# EAGLE schematic AFIBRPIComputeBoard (EAGLE 7.3.0)
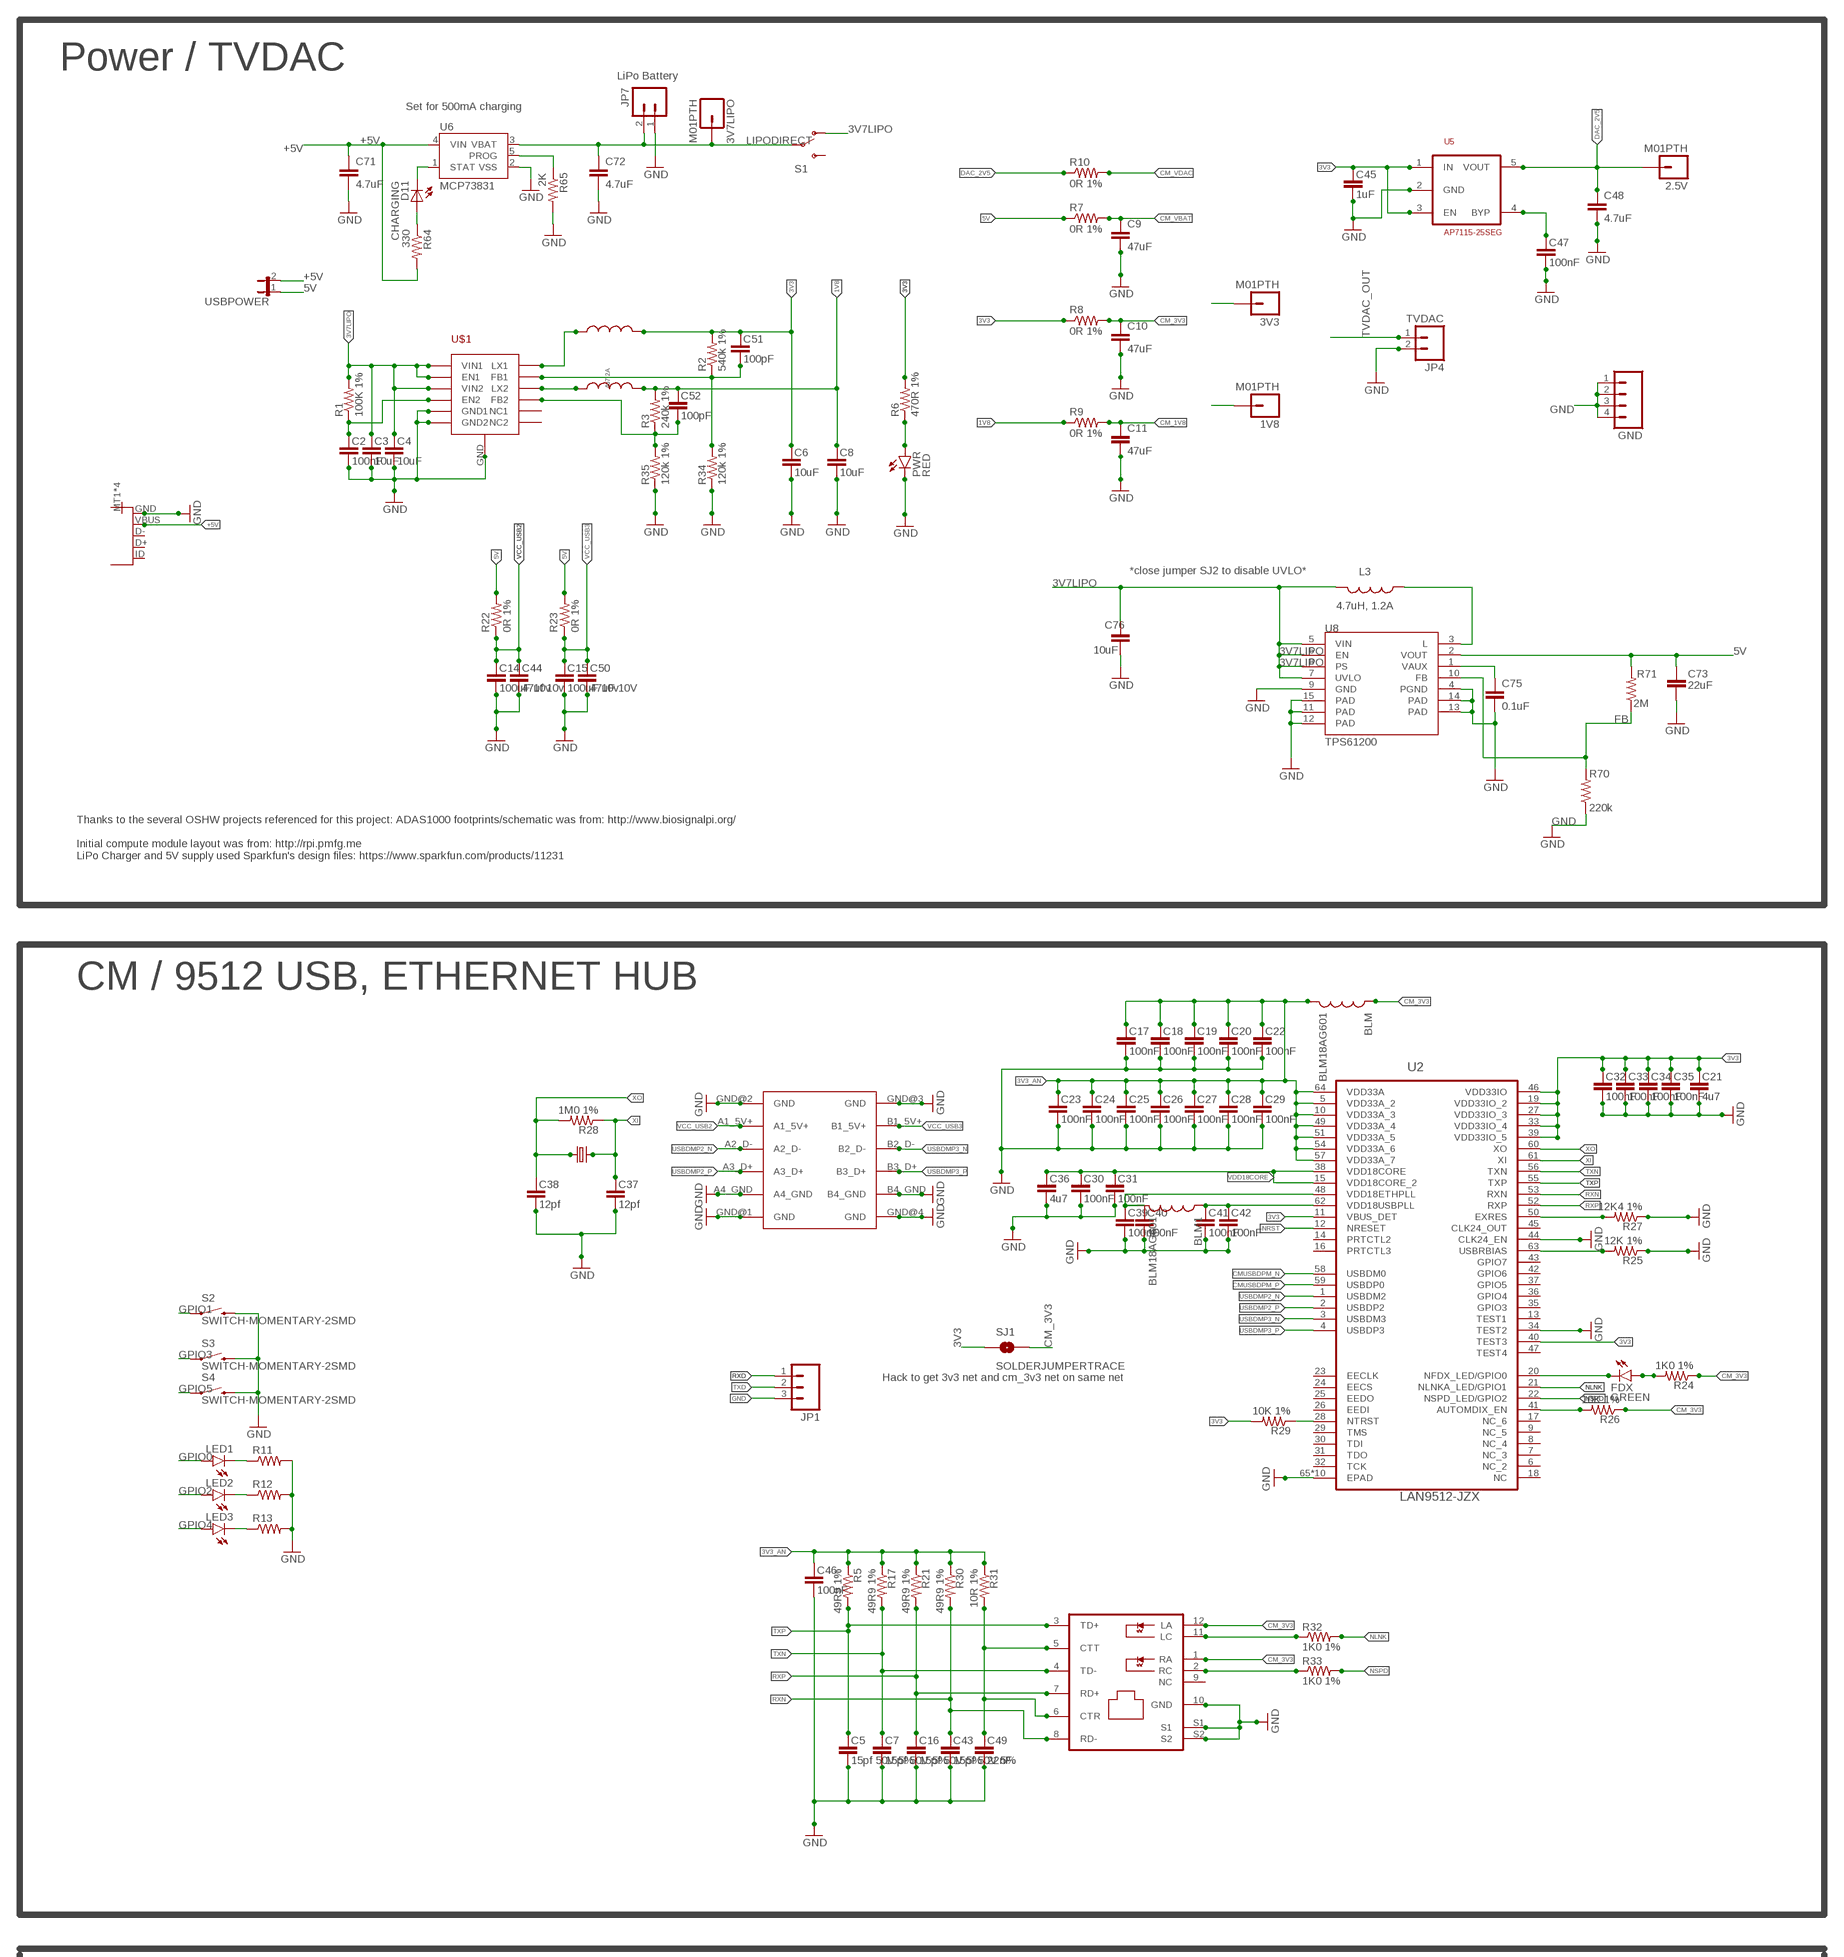
[diagram p0: schematic, sheet 1, part 1 of 3]
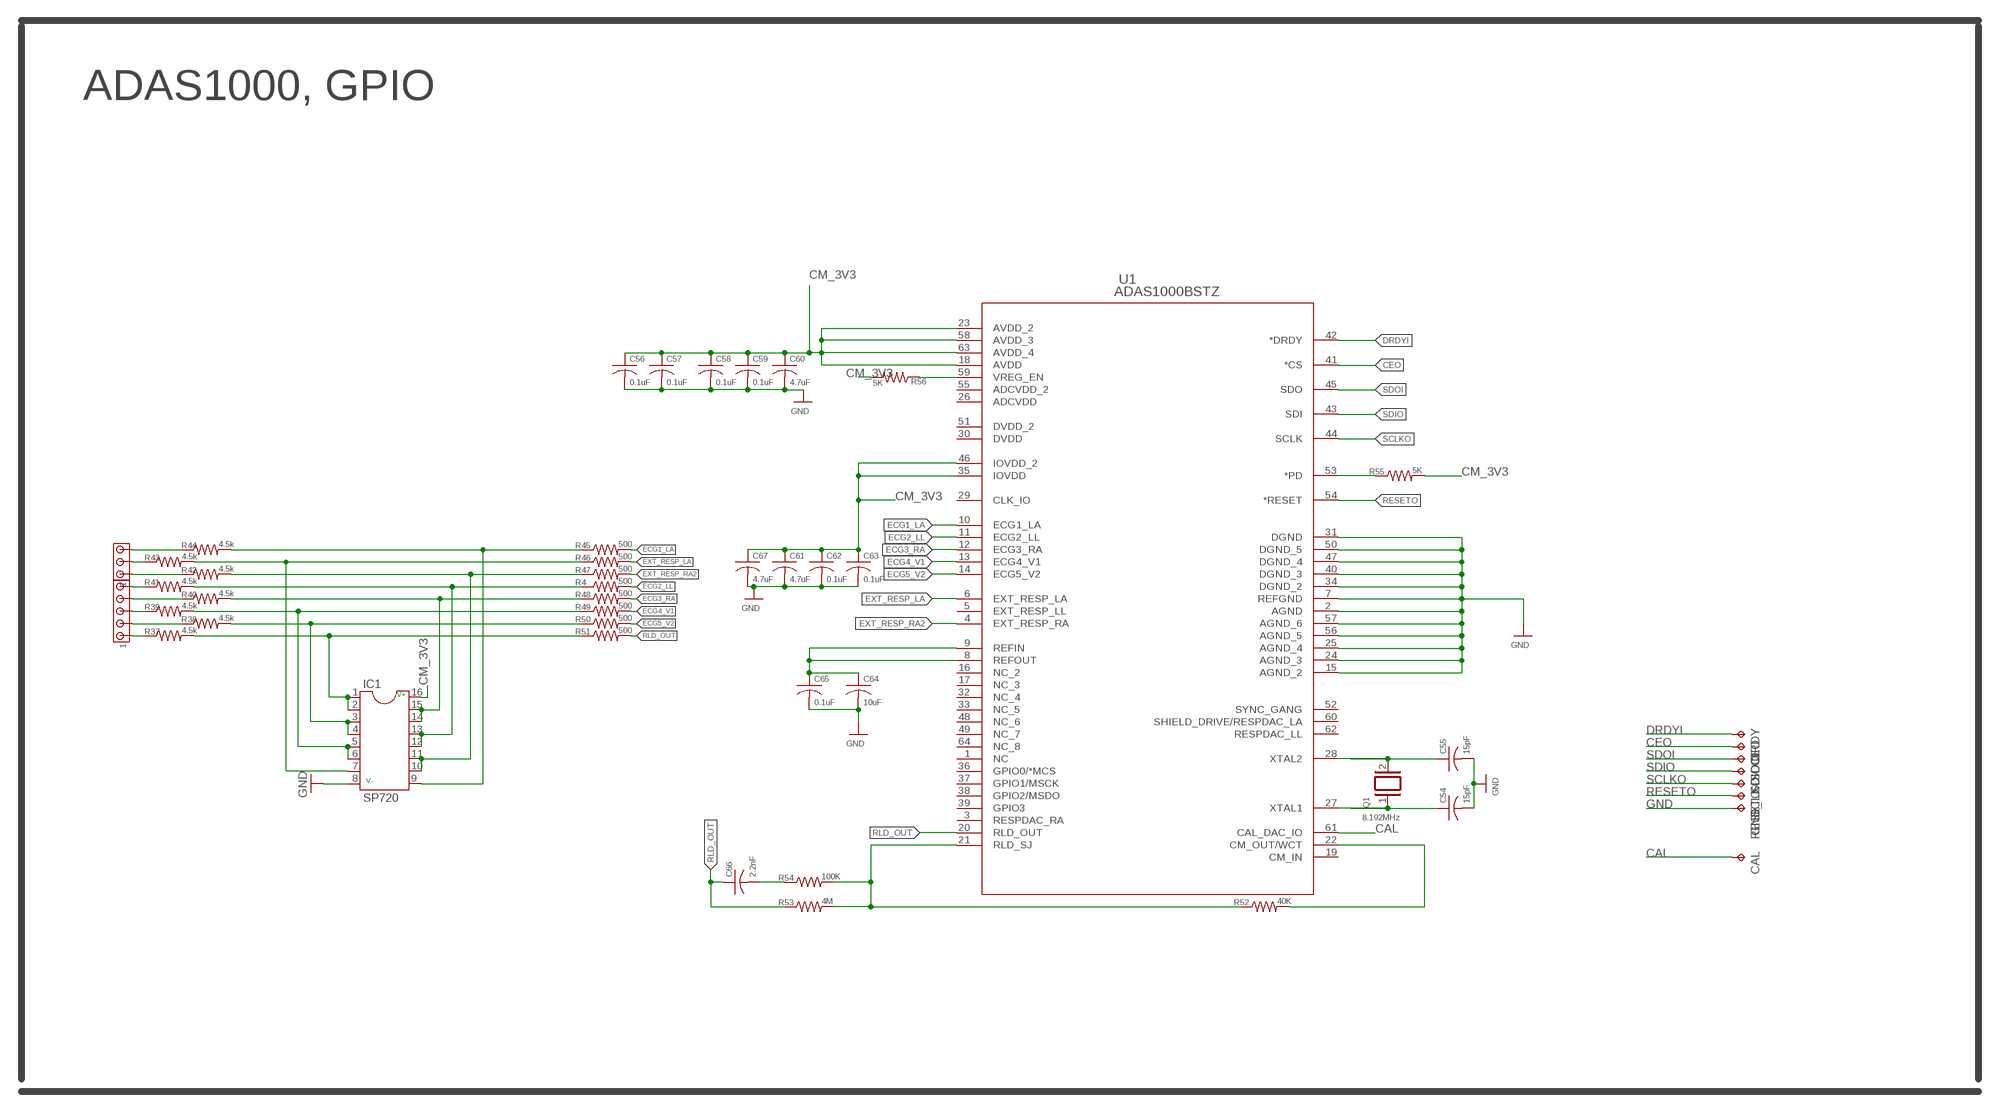
[diagram p1: schematic, sheet 1, part 2 of 3]
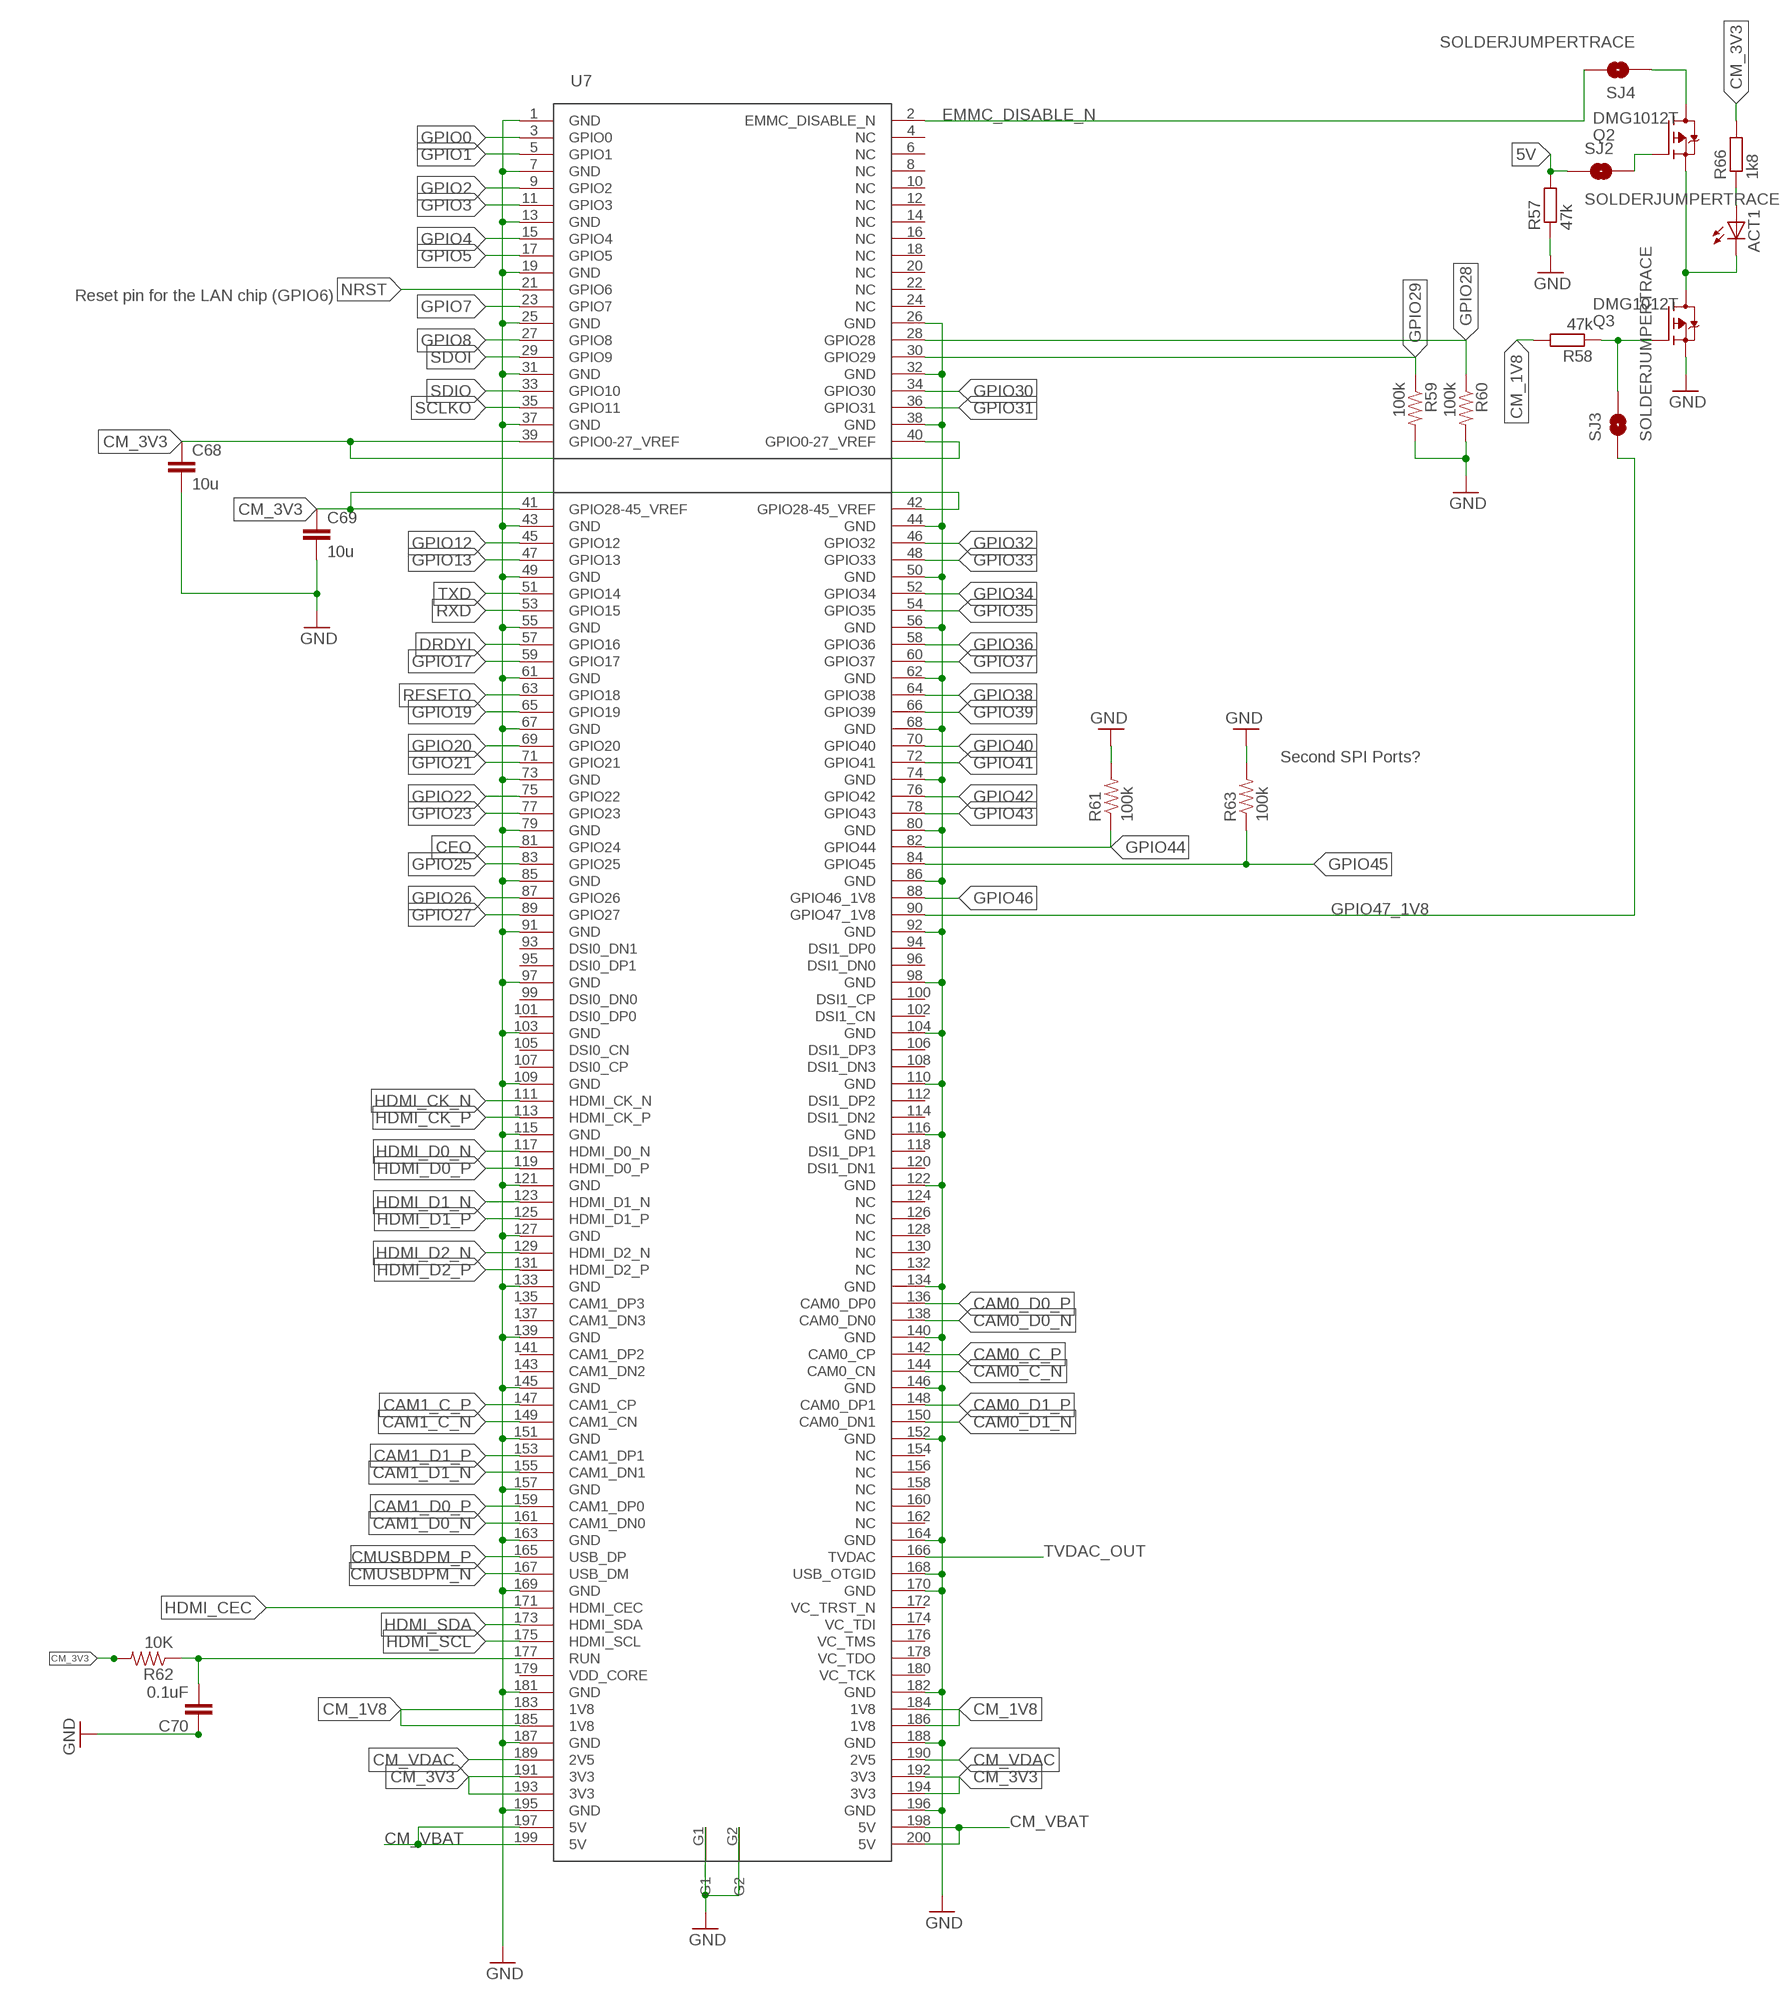
[diagram p2: schematic, sheet 1, part 3 of 3]

## Parts
1V8  M01PTH  [1X01]
2.5V  M01PTH  [1X01]
3V3  M01PTH  [1X01]
3V7LIPO  M01PTH  [1X01]
ACT1  LEDCHIP-LED0603  [CHIP-LED0603]
BLM  BLM18AG601  INDUCTOR0603  [0603]
BLM1  BLM18AG601  INDUCTOR0603  [0603]
C2  100nF  C_0402  [0402]
C3  10uF  C_0805  [0805]
C4  10uF  C_0805  [0805]
C5  15pf 50V 5%  C_0402  [0402]
C6  10uF  C_0805  [0805]
C7  15pf 50V 5%  C_0402  [0402]
C8  10uF  C_0805  [0805]
C9  47uF  CAP0603-CAP  [0603-CAP]
C10  47uF  CAP0603-CAP  [0603-CAP]
C11  47uF  CAP0603-CAP  [0603-CAP]
C14  100uF 10v  C_1206  [1206]
C15  100uF 10v  C_1206  [1206]
C16  15pf 50V 5%  C_0402  [0402]
C17  100nF  C_0402  [0402]
C18  100nF  C_0402  [0402]
C19  100nF  C_0402  [0402]
C20  100nF  C_0402  [0402]
C21  4u7  C_0402  [0402]
C22  100nF  C_0402  [0402]
C23  100nF  C_0402  [0402]
C24  100nF  C_0402  [0402]
C25  100nF  C_0402  [0402]
C26  100nF  C_0402  [0402]
C27  100nF  C_0402  [0402]
C28  100nF  C_0402  [0402]
C29  100nF  C_0402  [0402]
C30  100nF  C_0402  [0402]
C31  100nF  C_0402  [0402]
C32  100nF  C_0402  [0402]
C33  100nF  C_0402  [0402]
C34  100nF  C_0402  [0402]
C35  100nF  C_0402  [0402]
C36  4u7  C_0402  [0402]
C37  12pf  C_0402  [0402]
C38  12pf  C_0402  [0402]
C39  100nF  C_0402  [0402]
C40  100nF  C_0402  [0402]
C41  100nF  C_0402  [0402]
C42  100nF  C_0402  [0402]
C43  15pf 50V 5%  C_0402  [0402]
C44  47uf 10v  C_0805  [0805]
C45  1uF  C_0402  [0402]
C46  100nF  C_0402  [0402]
C47  100nF  C_0402  [0402]
C48  4.7uF  4.7UF-6.3V-10%(0603)0603  [0603-CAP]
C49  22nF  C_0805  [0805]
C50  47uF 10V  C_0805  [0805]
C51  100pF  C_0402  [0402]
C52  100pF  C_0402  [0402]
C54  15pF  C-USC0805  [C0805]
C55  15pF  C-USC0805  [C0805]
C56  0.1uF  C-USC0805  [C0805]
C57  0.1uF  C-USC0805  [C0805]
C58  0.1uF  C-USC0805  [C0805]
C59  0.1uF  C-USC0805  [C0805]
C60  4.7uF  C-USC0805  [C0805]
C61  4.7uF  C-USC0805  [C0805]
C62  0.1uF  C-USC0805  [C0805]
C63  0.1uF  C-USC0805  [C0805]
C64  10uF  C-USC0805  [C0805]
C65  0.1uF  C-USC0805  [C0805]
C66  2.2nF  C-USC0805  [C0805]
C67  4.7uF  C-USC0805  [C0805]
C68  10u  CAP0603-CAP  [0603-CAP]
C69  10u  CAP0603-CAP  [0603-CAP]
C70  0.1uF  CAP0603-CAP  [0603-CAP]
C71  4.7uF  CAP0402-CAP  [0402-CAP]
C72  4.7uF  CAP0402-CAP  [0402-CAP]
C73  22uF  CAP0603-CAP  [0603-CAP]
C75  0.1uF  CAP0603-CAP  [0603-CAP]
C76  10uF  CAP0603-CAP  [0603-CAP]
CAL  TPPAD1-13  [P1-13]
CEO  TPPAD1-13  [P1-13]
D11  CHARGING  LED0603  [LED-0603]
DRDY  TPPAD1-13  [P1-13]
FDX  GREEN  LED0603  [LED-0603]
GND  M04PTH  [1X04]
GND_  TPPAD1-13  [P1-13]
IC1  SP720  DIL16  [DIL16]
J1  J3011  [J30]
J2  JUMPERS  MTA03-100  [10X03MTA]
J3  JUMPERS  MTA05-100  [10X05MTA]
JP1  M03PTH  [1X03]
JP3  USB-IDMICRO  [USB-MICRO]
JP4  TVDAC  M02PTH  [1X02]
JP7  LiPo Battery  M02-JST-2MM-SMT  [JST-2-SMD]
L1  4.7u 2A  INDUCTOR-SRN4018  [SRN4018]
L2  4.7u 2A  INDUCTOR-SRN4018  [SRN4018]
L3  4.7uH, 1.2A  INDUCTOR.  [CDRH2D09]
LED1  LED0603  [LED-0603]
LED2  LED0603  [LED-0603]
LED3  LED0603  [LED-0603]
PWR  RED  LED0603  [LED-0603]
Q1  8.192MHz  XTAL/S  [QS]
Q2  DMG1012T  BSA223SP  [SC75_INFINEON]
Q3  DMG1012T  BSA223SP  [SC75_INFINEON]
R1  100K 1%  RESISTOR0402-RES  [0402-RES]
R2  540k 1%  RESISTOR0402-RES  [0402-RES]
R3  240k 1%  RESISTOR0402-RES  [0402-RES]
R4  500  RESISTOR0603  [0603-RES]
R5  49R9 1%  RESISTOR0402-RES  [0402-RES]
R6  470R 1%  RESISTOR0402-RES  [0402-RES]
R7  0R 1%  RESISTOR0603  [0603-RES]
R8  0R 1%  RESISTOR0603  [0603-RES]
R9  0R 1%  RESISTOR0603  [0603-RES]
R10  0R 1%  RESISTOR0603  [0603-RES]
R11  RESISTOR0603  [0603-RES]
R12  RESISTOR0603  [0603-RES]
R13  RESISTOR0603  [0603-RES]
R17  49R9 1%  RESISTOR0402-RES  [0402-RES]
R21  49R9 1%  RESISTOR0402-RES  [0402-RES]
R22  0R 1%  RESISTOR0603  [0603-RES]
R23  0R 1%  RESISTOR0603  [0603-RES]
R24  1K0 1%  RESISTOR0402-RES  [0402-RES]
R25  12K 1%  RESISTOR0402-RES  [0402-RES]
R26  10K 1%  RESISTOR0402-RES  [0402-RES]
R27  12K4 1%  RESISTOR0402-RES  [0402-RES]
R28  1M0 1%  RESISTOR0402-RES  [0402-RES]
R29  10K 1%  RESISTOR0402-RES  [0402-RES]
R30  49R9 1%  RESISTOR0402-RES  [0402-RES]
R31  10R 1%  RESISTOR0402-RES  [0402-RES]
R32  1K0 1%  RESISTOR0402-RES  [0402-RES]
R33  1K0 1%  RESISTOR0402-RES  [0402-RES]
R34  120k 1%  RESISTOR0402-RES  [0402-RES]
R35  120k 1%  RESISTOR0402-RES  [0402-RES]
R37  4.5k  RESISTOR0603-RES  [0603-RES]
R38  4.5k  RESISTOR0603-RES  [0603-RES]
R39  4.5k  RESISTOR0603-RES  [0603-RES]
R40  4.5k  RESISTOR0603-RES  [0603-RES]
R41  4.5k  RESISTOR0603-RES  [0603-RES]
R42  4.5k  RESISTOR0603-RES  [0603-RES]
R43  4.5k  RESISTOR0603-RES  [0603-RES]
R44  4.5k  RESISTOR0603-RES  [0603-RES]
R45  500  RESISTOR0603  [0603-RES]
R46  500  RESISTOR0603  [0603-RES]
R47  500  RESISTOR0603  [0603-RES]
R48  500  RESISTOR0603  [0603-RES]
R49  500  RESISTOR0603  [0603-RES]
R50  500  RESISTOR0603  [0603-RES]
R51  500  RESISTOR0603  [0603-RES]
R52  40K  RESISTOR0603-RES  [0603-RES]
R53  4M  RESISTOR0603-RES  [0603-RES]
R54  100K  RESISTOR0603-RES  [0603-RES]
R55  5K  RESISTOR0603-RES  [0603-RES]
R56  5K  RESISTOR0603-RES  [0603-RES]
R57  47k  R-EU_R0603  [R0603]
R58  47k  R-EU_R0603  [R0603]
R59  100k  RESISTOR0603  [0603-RES]
R60  100k  RESISTOR0603  [0603-RES]
R61  100k  RESISTOR0603  [0603-RES]
R62  10K  RESISTOR0603  [0603-RES]
R63  100k  RESISTOR0603  [0603-RES]
R64  330  RESISTOR0402-RES  [0402-RES]
R65  2K  RESISTOR0402-RES  [0402-RES]
R66  1k8  R-EU_R0603  [R0603]
R70  220k  RESISTOR0402-RES  [0402-RES]
R71  2M  RESISTOR0402-RES  [0402-RES]
RESETO  TPPAD1-13  [P1-13]
S1  SWITCH-SPDT-SMD-A  [SWITCH-SPST-SMD-A]
S2  SWITCH-MOMENTARY-2SMD  [TACTILE-SWITCH-SMD]
S3  SWITCH-MOMENTARY-2SMD  [TACTILE-SWITCH-SMD]
S4  SWITCH-MOMENTARY-2SMD  [TACTILE-SWITCH-SMD]
SCLKO  TPPAD1-13  [P1-13]
SDIO  TPPAD1-13  [P1-13]
SDOI  TPPAD1-13  [P1-13]
SJ1  SOLDERJUMPERTRACE  [SJ_2S-TRACE]
SJ2  SOLDERJUMPERTRACE  [SJ_2S-TRACE]
SJ3  SOLDERJUMPERTRACE  [SJ_2S-TRACE]
SJ4  SOLDERJUMPERTRACE  [SJ_2S-TRACE]
U1  ADAS1000BSTZ  [ST_64_2]
U2  LAN9512-JZX  [QFN50P900X900X100-65N]
U5  AP7115-25SEG  74LVC1G79GW  [SOT353]
U6  MCP73831  [SOT23-5]
U7  RASPI  [SO-DIMM]
U8  TPS61200  [QFN-10_PAD]
U$1  WDFN-12L  [WDFN-12L]
USB1  72309USB-TYPE-A  [72309]
USBPOWER  JUMPER-2PTH  [1X02]
Y1  CRYSTAL5X3  [CRYSTAL-SMD-5X3]

## Nets
1V8: C8.1 C52.1 L2.P$2 R3.2 R9.1
3V3: C6.1 C21.1 C32.1 C33.1 C34.1 C35.1 C45.1 C51.1 L1.P$2 R2.2 R6.2 R8.1 R29.2 SJ1.1 U2.11(VBUS_DET) U2.19(VDD33IO_2) U2.27(VDD33IO_3) U2.33(VDD33IO_4) U2.39(VDD33IO_5) U2.40(TEST3) U2.46(VDD33IO) U5.1(IN) U5.3(EN)
3V3_AN: BLM.2 C17.1 C18.1 C19.1 C20.1 C22.1 C23.1 C24.1 C25.1 C26.1 C27.1 C28.1 C29.1 C46.1 R5.1 R17.1 R21.1 R30.1 R31.1 U2.5(VDD33A_2) U2.10(VDD33A_3) U2.49(VDD33A_4) U2.51(VDD33A_5) U2.54(VDD33A_6) U2.57(VDD33A_7) U2.64(VDD33A)
3V7LIPO: C3.1 C4.1 C76.1 L3.P$2 R1.2 S1.1(O) U8.5(VIN) U8.6(EN) U8.7(UVLO) U8.8(PS) U$1.1(VIN2) U$1.6(EN1) U$1.7(VIN1)
5V: C73.1 R7.1 R22.2 R23.2 R57.2 R71.2 SJ2.1 U8.2(VOUT) USBPOWER.1
+5V: C71.1 JP3.VBUS R64.2 U6.4(VIN) USBPOWER.2
CAL: CAL.TP U1.61(CAL_DAC_IO)
CAM0_C_N: U7.144(CAM0_CN)
CAM0_C_P: U7.142(CAM0_CP)
CAM0_D0_N: U7.138(CAM0_DN0)
CAM0_D0_P: U7.136(CAM0_DP0)
CAM0_D1_N: U7.150(CAM0_DN1)
CAM0_D1_P: U7.148(CAM0_DP1)
CAM1_C_N: U7.149(CAM1_CN)
CAM1_C_P: U7.147(CAM1_CP)
CAM1_D0_N: U7.161(CAM1_DN0)
CAM1_D0_P: U7.159(CAM1_DP0)
CAM1_D1_N: U7.155(CAM1_DN1)
CAM1_D1_P: U7.153(CAM1_DP1)
CEO: CEO.TP U1.41(*CS) U7.81(GPIO24)
CM_1V8: 1V8.1 C11.1 R9.2 R58.2 U7.183(1V8) U7.184(1V8) U7.185(1V8) U7.186(1V8)
CM_3V3: 3V3.1 BLM.1 C10.1 C56.1 C57.1 C58.1 C59.1 C60.1 C61.1 C62.1 C63.1 C67.1 C68.1 C69.1 IC1.16 J1.1(RA) J1.12(LA) R8.2 R24.1 R26.1 R55.2 R56.2 R62.2 R66.2 SJ1.2 U1.18(AVDD) U1.23(AVDD_2) U1.35(IOVDD) U1.46(IOVDD_2) U1.58(AVDD_3) U1.63(AVDD_4) U7.39(GPIO0-27_VREF) U7.40(GPIO0-27_VREF) U7.41(GPIO28-45_VREF) U7.42(GPIO28-45_VREF) U7.191(3V3) U7.192(3V3) U7.193(3V3) U7.194(3V3)
CM_VBAT: C9.1 R7.2 U7.197(5V) U7.198(5V) U7.199(5V) U7.200(5V)
CM_VDAC: R10.2 U7.189(2V5) U7.190(2V5)
CMUSBDPM_N: U2.58(USBDM0) U7.167(USB_DM)
CMUSBDPM_P: U2.59(USBDP0) U7.165(USB_DP)
DAC_2V5: 2.5V.1 C48.1 R10.1 U5.5(VOUT)
DRDYI: DRDY.TP U1.42(*DRDY) U7.57(GPIO16)
ECG1_LA: R45.2 U1.10(ECG1_LA)
ECG2_LL: R4.2 U1.11(ECG2_LL)
ECG3_RA: R48.2 U1.12(ECG3_RA)
ECG4_V1: R49.2 U1.13(ECG4_V1)
ECG5_V2: R50.2 U1.14(ECG5_V2)
EMMC_DISABLE_N: SJ4.2 U7.2(EMMC_DISABLE_N)
EXT_RESP_LA: R46.2 U1.6(EXT_RESP_LA)
EXT_RESP_RA2: R47.2 U1.4(EXT_RESP_RA)
FB: R70.2 R71.1 U8.10(FB)
GND: C2.2 C3.2 C4.2 C5.2 C6.2 C7.2 C8.2 C9.2 C10.2 C11.2 C14.2 C15.2 C16.2 C17.2 C18.2 C19.2 C20.2 C21.2 C22.2 C23.2 C24.2 C25.2 C26.2 C27.2 C28.2 C29.2 C30.2 C31.2 C32.2 C33.2 C34.2 C35.2 C36.2 C37.2 C38.2 C39.2 C40.2 C41.2 C42.2 C43.2 C44.2 C45.2 C46.2 C47.2 C48.2 C49.2 C50.2 C54.2 C55.2 C56.2 C57.2 C58.2 C59.2 C60.2 C61.2 C62.2 C63.2 C64.2 C65.2 C67.2 C68.2 C69.2 C70.1 C71.2 C72.2 C73.2 C75.2 C76.2 GND.1 GND.2 GND.3 GND.4 GND_.TP IC1.8 J1.10(GND) J1.S1 J1.S2 JP1.3 JP3.GND JP4.2 JP7.1 Q3.3(S) R11.2 R12.2 R13.2 R25.1 R27.1 R34.1 R35.1 R57.1 R59.2 R60.2 R61.2 R63.2 R65.2 R70.1 S2.3 S3.3 S4.3 U1.2(AGND) U1.7(REFGND) U1.15(AGND_2) U1.24(AGND_3) U1.25(AGND_4) U1.31(DGND) U1.34(DGND_2) U1.40(DGND_3) U1.47(DGND_4) U1.50(DGND_5) U1.56(AGND_5) U1.57(AGND_6) U2.34(TEST2) U2.44(CLK24_EN) U2.65(EPAD) U2.GND@1(EPAD) U2.GND@2(EPAD) U2.GND@3(EPAD) U2.GND@4(EPAD) U2.GND@5(EPAD) U2.GND@6(EPAD) U2.GND@7(EPAD) U2.GND@8(EPAD) U2.GND@9(EPAD) U5.2(GND) U6.2(VSS) U7.1(GND) U7.7(GND) U7.13(GND) U7.19(GND) U7.25(GND) U7.26(GND) U7.31(GND) U7.32(GND) U7.37(GND) U7.38(GND) U7.43(GND) U7.44(GND) U7.49(GND) U7.50(GND) U7.55(GND) U7.56(GND) U7.61(GND) U7.62(GND) U7.67(GND) U7.68(GND) U7.73(GND) U7.74(GND) U7.79(GND) U7.80(GND) U7.85(GND) U7.86(GND) U7.91(GND) U7.92(GND) U7.97(GND) U7.98(GND) U7.103(GND) U7.104(GND) U7.109(GND) U7.110(GND) U7.115(GND) U7.116(GND) U7.121(GND) U7.122(GND) U7.127(GND) U7.133(GND) U7.134(GND) U7.139(GND) U7.140(GND) U7.145(GND) U7.146(GND) U7.151(GND) U7.152(GND) U7.157(GND) U7.163(GND) U7.164(GND) U7.168(USB_OTGID) U7.169(GND) U7.170(GND) U7.181(GND) U7.182(GND) U7.187(GND) U7.188(GND) U7.195(GND) U7.196(GND) U7.G1 U7.G2 U8.4(PGND) U8.9(GND) U8.11(PAD) U8.12(PAD) U8.13(PAD) U8.14(PAD) U8.15(PAD) U$1.3(GND1) U$1.9(GND2) U$1.GND USB1.A4_GND USB1.B4_GND USB1.GND@1(GND) USB1.GND@2(GND) USB1.GND@3(GND) USB1.GND@4(GND)
GPIO0: LED1.A U7.3(GPIO0)
GPIO1: S2.1 U7.5(GPIO1)
GPIO2: LED2.A U7.9(GPIO2)
GPIO3: S3.1 U7.11(GPIO3)
GPIO4: LED3.A U7.15(GPIO4)
GPIO5: S4.1 U7.17(GPIO5)
GPIO7: U7.23(GPIO7)
GPIO8: U7.27(GPIO8)
GPIO12: U7.45(GPIO12)
GPIO13: U7.47(GPIO13)
GPIO17: U7.59(GPIO17)
GPIO19: U7.65(GPIO19)
GPIO20: U7.69(GPIO20)
GPIO21: U7.71(GPIO21)
GPIO22: U7.75(GPIO22)
GPIO23: U7.77(GPIO23)
GPIO25: U7.83(GPIO25)
GPIO26: U7.87(GPIO26)
GPIO27: U7.89(GPIO27)
GPIO28: R60.1 U7.28(GPIO28)
GPIO29: R59.1 U7.30(GPIO29)
GPIO30: U7.34(GPIO30)
GPIO31: U7.36(GPIO31)
GPIO32: U7.46(GPIO32)
GPIO33: U7.48(GPIO33)
GPIO34: U7.52(GPIO34)
GPIO35: U7.54(GPIO35)
GPIO36: U7.58(GPIO36)
GPIO37: U7.60(GPIO37)
GPIO38: U7.64(GPIO38)
GPIO39: U7.66(GPIO39)
GPIO40: U7.70(GPIO40)
GPIO41: U7.72(GPIO41)
GPIO42: U7.76(GPIO42)
GPIO43: U7.78(GPIO43)
GPIO44: R61.1 U7.82(GPIO44)
GPIO45: R63.1 U7.84(GPIO45)
GPIO46: U7.88(GPIO46_1V8)
GPIO47_1V8: SJ3.1 U7.90(GPIO47_1V8)
HDMI_CEC: U7.171(HDMI_CEC)
HDMI_CK_N: U7.111(HDMI_CK_N)
HDMI_CK_P: U7.113(HDMI_CK_P)
HDMI_D0_N: U7.117(HDMI_D0_N)
HDMI_D0_P: U7.119(HDMI_D0_P)
HDMI_D1_N: U7.123(HDMI_D1_N)
HDMI_D1_P: U7.125(HDMI_D1_P)
HDMI_D2_N: U7.129(HDMI_D2_N)
HDMI_D2_P: U7.131(HDMI_D2_P)
HDMI_SCL: U7.175(HDMI_SCL)
HDMI_SDA: U7.173(HDMI_SDA)
JUMPERS: J2.1 R42.1
LIPODIRECT: 3V7LIPO.1 C72.1 JP7.2 S1.2(P) U6.3(VBAT)
N$1: L1.P$1 U$1.8(LX1)
N$2: C51.2 R2.1 R34.2 U$1.4(FB1)
N$3: C2.1 R1.1 U$1.12(EN2)
N$4: L2.P$1 U$1.2(LX2)
N$6: C52.2 R3.1 R35.2 U$1.10(FB2)
N$7: PWR.A R6.1
N$9: Q2.2(D) SJ4.1
N$10: Q3.1(G) R58.1 SJ3.2
N$11: LED3.C R13.1
N$12: LED2.C R12.1
N$13: FDX.A R24.2
N$14: LED1.C R11.1
N$15: Q2.1(G) SJ2.2
N$16: R25.2 U2.63(USBRBIAS)
N$17: PWR.C
N$19: J3.1 R37.1
N$21: C47.1 U5.4(BYP)
N$22: BLM1.1 C41.1 C42.1 U2.62(VDD18USBPLL)
N$23: BLM1.2 C39.1 C40.1 U2.48(VDD18ETHPLL)
N$24: R26.2 U2.41(AUTOMDIX_EN)
N$25: R27.2 U2.50(EXRES)
N$26: R29.1 U2.28(NTRST)
N$27: J1.11(LC) R32.1
N$28: J1.2(RC) R33.1
N$29: C49.1 J1.5(CTT) J1.6(CTR) R31.2
N$30: FDX.C U2.20(NFDX_LED/GPIO0)
N$35: J3.2 R38.1
N$37: J3.3 R39.1
N$38: J3.4 R40.1
N$39: J3.5 R41.1
N$40: J2.2 R43.1
N$41: J2.3 R44.1
N$42: IC1.9 R44.2 R45.1
N$43: IC1.7 R43.2 R46.1
N$44: IC1.3 IC1.4 R38.2 R50.1
N$45: IC1.5 IC1.6 R39.2 R49.1
N$46: IC1.1 IC1.2 R37.2 R51.1
N$47: IC1.14 IC1.15 R40.2 R48.1
N$48: IC1.12 IC1.13 R4.1 R41.2
N$49: IC1.10 IC1.11 R42.2 R47.1
N$50: C55.1 Q1.2 U1.28(XTAL2)
N$51: C54.1 Q1.1 U1.27(XTAL1)
N$52: C66.2 R54.1
N$53: R55.1 U1.53(*PD)
N$54: R56.1 U1.59(VREG_EN)
N$55: R52.2 U1.22(CM_OUT/WCT)
N$56: C64.1 C65.1 U1.8(REFOUT) U1.9(REFIN)
N$57: R52.1 R53.2 R54.2 U1.21(RLD_SJ)
N$60: ACT1.C Q2.3(S) Q3.2(D)
N$61: D11.A R64.1
N$62: L3.P$1 U8.3(L)
N$63: C75.1 U8.1(VAUX)
N$65: ACT1.A R66.1
NLNK: R32.2 U2.21(NLNKA_LED/GPIO1)
NRST: U2.12(NRESET) U7.21(GPIO6)
NSPD: R33.2 U2.22(NSPD_LED/GPIO2)
PROG: R65.1 U6.5(PROG)
RESETO: RESETO.TP U1.54(*RESET) U7.63(GPIO18)
RLD_OUT: C66.1 R51.2 R53.1 U1.20(RLD_OUT)
RUNPIN: C70.2 R62.1 U7.177(RUN)
RXD: JP1.1 U7.53(GPIO15)
RXN: C43.1 J1.8(RD-) R30.2 U2.53(RXN)
RXP: C16.1 J1.7(RD+) R21.2 U2.52(RXP)
SCLKO: SCLKO.TP U1.44(SCLK) U7.35(GPIO11)
SDIO: SDIO.TP U1.43(SDI) U7.33(GPIO10)
SDOI: SDOI.TP U1.45(SDO) U7.29(GPIO9)
STAT: D11.C U6.1(STAT)
TVDAC_OUT: JP4.1 U7.166(TVDAC)
TXD: JP1.2 U7.51(GPIO14)
TXN: C7.1 J1.4(TD-) R17.2 U2.56(TXN)
TXP: C5.1 J1.3(TD+) R5.2 U2.55(TXP)
USBDMP2_N: U2.1(USBDM2) USB1.A2_D-
USBDMP2_P: U2.2(USBDP2) USB1.A3_D+
USBDMP3_N: U2.3(USBDM3) USB1.B2_D-
USBDMP3_P: U2.4(USBDP3) USB1.B3_D+
VCC_USB2: C14.1 C44.1 R22.1 USB1.A1_5V+
VCC_USB3: C15.1 C50.1 R23.1 USB1.B1_5V+
VDD18CORE: C30.1 C31.1 C36.1 U2.15(VDD18CORE_2) U2.38(VDD18CORE)
XI: C37.1 R28.1 U2.61(XI) Y1.3
XO: C38.1 R28.2 U2.60(XO) Y1.1
Unconnected: J1.9(NC) JP3.D+ JP3.D- JP3.ID JP3.MT1(SHELL) JP3.MT2(SHELL) JP3.P$1(SHELL) JP3.P$2(SHELL) S1.3(S) U1.1(NC) U1.3(RESPDAC_RA) U1.5(EXT_RESP_LL) U1.16(NC_2) U1.17(NC_3) U1.19(CM_IN) U1.26(ADCVDD) U1.29(CLK_IO) U1.30(DVDD) U1.32(NC_4) U1.33(NC_5) U1.36(GPIO0/*MCS) U1.37(GPIO1/MSCK) U1.38(GPIO2/MSDO) U1.39(GPIO3) U1.48(NC_6) U1.49(NC_7) U1.51(DVDD_2) U1.52(SYNC_GANG) U1.55(ADCVDD_2) U1.60(SHIELD_DRIVE/RESPDAC_LA) U1.62(RESPDAC_LL) U1.64(NC_8) U2.6(NC_2) U2.7(NC_3) U2.8(NC_4) U2.9(NC_5) U2.13(TEST1) U2.14(PRTCTL2) U2.16(PRTCTL3) U2.17(NC_6) U2.18(NC) U2.23(EECLK) U2.24(EECS) U2.25(EEDO) U2.26(EEDI) U2.29(TMS) U2.30(TDI) U2.31(TDO) U2.32(TCK) U2.35(GPIO3) U2.36(GPIO4) U2.37(GPIO5) U2.42(GPIO6) U2.43(GPIO7) U2.45(CLK24_OUT) U2.47(TEST4) U7.4(NC) U7.6(NC) U7.8(NC) U7.10(NC) U7.12(NC) U7.14(NC) U7.16(NC) U7.18(NC) U7.20(NC) U7.22(NC) U7.24(NC) U7.93(DSI0_DN1) U7.94(DSI1_DP0) U7.95(DSI0_DP1) U7.96(DSI1_DN0) U7.99(DSI0_DN0) U7.100(DSI1_CP) U7.101(DSI0_DP0) U7.102(DSI1_CN) U7.105(DSI0_CN) U7.106(DSI1_DP3) U7.107(DSI0_CP) U7.108(DSI1_DN3) U7.112(DSI1_DP2) U7.114(DSI1_DN2) U7.118(DSI1_DP1) U7.120(DSI1_DN1) U7.124(NC) U7.126(NC) U7.128(NC) U7.130(NC) U7.132(NC) U7.135(CAM1_DP3) U7.137(CAM1_DN3) U7.141(CAM1_DP2) U7.143(CAM1_DN2) U7.154(NC) U7.156(NC) U7.158(NC) U7.160(NC) U7.162(NC) U7.172(VC_TRST_N) U7.174(VC_TDI) U7.176(VC_TMS) U7.178(VC_TDO) U7.179(VDD_CORE) U7.180(VC_TCK) U$1.5(NC1) U$1.11(NC2)

## Notes on the sheet
- Power / TVDAC
- Set for 500mA charging
- *close jumper SJ2 to disable UVLO*
- Thanks to the several OSHW projects referenced for this project: ADAS1000 footprints/schematic was from: http://www.biosignalpi.org/
  
  Initial compute module layout was from: http://rpi.pmfg.me
  LiPo Charger and 5V supply used Sparkfun's design files: https://www.sparkfun.com/products/11231
- CM / 9512 USB, ETHERNET HUB
- Hack to get 3v3 net and cm_3v3 net on same net
- ADAS1000, GPIO
- V+
- V-
- Reset pin for the LAN chip (GPIO6)
- Second SPI Ports?

## Library data of the parts
1V8 2.5V 3V3 3V7LIPO = SparkFun-Connectors:M01: Header 1 Standard 1-pin 0.1" header. Use with straight break away headers (SKU : PRT-00116), right angle break away headers (PRT-00553), swiss pins (PRT-00743), machine pins (PRT-00117), and female headers (PRT-00115).
ACT1 = led:LED: LED OSRAM: - CHIPLED LG R971, LG N971, LY N971, LG Q971, LY Q971, LO R971, LY R971 LH N974, LH R974 LS Q976, LO Q976, LY Q976 LO Q996 - Hyper CHIPLED LW Q18S LB Q993, LB Q99A, LB R99A - SideLED LS A670, LO A670, LY A670, LG A670, LP A670 LB A673, LV A673, LT A673, LW A673 LH A674 LY A675 LS A676, LA A676, LO A676, LY A676, LW A676 LS A679, LY A679, LG A679 - Hyper Micro SIDELED® LS Y876, LA Y876, LO Y876, LY Y876 LT Y87S - SmartLED LW L88C, LW L88S LB L89C, LB L89S, LG L890 LS L89K, LO L89K, LY L89K LS L896, LA L896, LO L896, LY L896 - TOPLED LS T670, LO T670, LY T670, LG T670, LP T670 LSG T670, LSP T670, LSY T670, LOP T670, LYG T670 LG T671, LOG T671, LSG T671 LB T673, LV T673, LT T673, LW T673 LH T674 LS T676, LA T676, LO T676, LY T676, LB T676, LH T676, LSB T676, LW T676 LB T67C, LV T67C, LT T67C, LS T67K, LO T67K, LY T67K, LW E67C LS E67B, LA E67B, LO E67B, LY E67B, LB E67C, LV E67C, LT E67C LW T67C LS T679, LY T679, LG T679 LS T770, LO T770, LY T770, LG T770, LP T770 LB T773, LV T773, LT T773, LW T773 LH T774 LS E675, LA E675, LY E675, LS T675 LS T776, LA T776, LO T776, LY T776, LB T776 LHGB T686 LT T68C, LB T68C - Hyper Mini TOPLED® LB M676 - Mini TOPLED Santana® LG M470 LS M47K, LO M47K, LY M47K Source: http://www.osram.convergy.de LUXEON: - LUMILED® LXK2-PW12-R00, LXK2-PW12-S00, LXK2-PW14-U00, LXK2-PW14-V00 LXK2-PM12-R00, LXK2-PM12-S00, LXK2-PM14-U00 LXK2-PE12-Q00, LXK2-PE12-R00, LXK2-PE12-S00, LXK2-PE14-T00, LXK2-PE14-U00 LXK2-PB12-K00, LXK2-PB12-L00, LXK2-PB12-M00, LXK2-PB14-N00, LXK2-PB14-P00, LXK2-PB14-Q00 LXK2-PR12-L00, LXK2-PR12-M00, LXK2-PR14-Q00, LXK2-PR14-R00 LXK2-PD12-Q00, LXK2-PD12-R00, LXK2-PD12-S00 LXK2-PH12-R00, LXK2-PH12-S00 LXK2-PL12-P00, LXK2-PL12-Q00, LXK2-PL12-R00 Source: www.luxeon.com KINGBRIGHT: KA-3528ASYC Source: www.kingbright.com
BLM BLM1 = SparkFun-Passives:INDUCTOR: Inductors
C2 C5 C7 C14-C43 C45-C47 C51 C52 = C:C
C3 C4 C6 C8 C44 C49 C50 = C:C; MN: TDK Corp.; PARTNO: C2012X5R1Cxxxxxxx; VID: DK
C9-C11 C68-C70 C73 C75 C76 = SparkFun-Passives:CAP: Capacitor Standard 0603 ceramic capacitor, and 0.1" leaded capacitor.
C48 = SparkFun-Capacitors:4.7UF-6.3V-10%(0603): CAP-08280; PROD_ID: CAP-08280
C54-C67 = rcl:C-US: CAPACITOR, American symbol
C71 C72 = SparkFun:CAP: Capacitor Standard 0603 ceramic capacitor, and 0.1" leaded capacitor.
CAL CEO DRDY GND_ RESETO SCLKO SDIO SDOI = testpad:TP: Test pad
D11 = SparkFun:LED: LEDs Standard schematic elements and footprints for 5mm, 3mm, 1206, and 0603 sized LEDs. 5mm - Spark Fun Electronics SKU : COM-00529 (and others)
FDX LED1-LED3 PWR = SparkFun-LED:LED: LEDs Standard schematic elements and footprints for 5mm, 3mm, 1206, and 0603 sized LEDs. 5mm - Spark Fun Electronics SKU : COM-00529 (and others)
GND = SparkFun-Connectors:M04: Header 4 Standard 4-pin 0.1" header. Use with straight break away headers (SKU : PRT-00116), right angle break away headers (PRT-00553), swiss pins (PRT-00743), machine pins (PRT-00117), and female headers (PRT-00115). Molex polarized connector foot print use with SKU : PRT-08231 with associated crimp pins and housings. 1MM SMD Version SKU: PRT-10208
IC1 = ic-packageEdit:DIL16: Dual In Line / Socket
J1 = J3011:J3011
J2 = con-amp:MTA03-100: AMP connector
J3 = con-amp:MTA05-100: AMP connector
JP1 = SparkFun-Connectors:M03: Header 3 Standard 3-pin 0.1" header. Use with straight break away headers (SKU : PRT-00116), right angle break away headers (PRT-00553), swiss pins (PRT-00743), machine pins (PRT-00117), and female headers (PRT-00115). Molex polarized connector foot print use with SKU : PRT-08232 with associated crimp pins and housings.
JP3 = USB-ID:USB-ID; PROD_ID: CONN-09505
JP4 = SparkFun-Connectors:M02: Standard 2-pin 0.1" header. Use with - straight break away headers ( PRT-00116) - right angle break away headers (PRT-00553) - swiss pins (PRT-00743) - machine pins (PRT-00117) - female headers (PRT-00115) Molex polarized connector foot print use with: PRT-08233 with associated crimp pins and housings. 2.54_SCREWTERM for use with PRT-10571. 3.5mm Screw Terminal footprints for PRT-08084 5mm Screw Terminal footprints for use with PRT-08433
JP7 = SparkFun:M02: Header 2 Standard 2-pin 0.1" header. Use with straight break away headers (SKU : PRT-00116), right angle break away headers (PRT-00553), swiss pins (PRT-00743), machine pins (PRT-00117), and female headers (PRT-00115). Molex polarized connector foot print use with SKU : PRT-08233 with associated crimp pins and housings.
L1 = INDUCTOR:INDUCTOR
L2 = INDUCTOR:INDUCTOR; L2: 4u7 2A
L3 = SparkFun:INDUCTOR: Inductors
Q1 = special:XTAL/S: CRYSTAL
Q2 Q3 = transistor-fet:BSA223SP: OptiMOS(R)-P Small-Signal-Transistor P-Channel, Enhancement mode, Super Logic Level (2.5 V rated) Source: http://www.infineon.com/upload/Document/BSA223SP_Rev1.3.pdf
R1-R3 R5 R6 R17 R21 R24-R35 = RESISTORS:RESISTOR
R4 R7-R10 R22 R23 R45-R51 R59-R63 = SparkFun-ResistorsCustomer:RESISTOR: Resistor Basic schematic elements and footprints for 0603, 1206, and PTH resistors.
R11-R13 = SparkFun-Resistors:RESISTOR: Resistor Basic schematic elements and footprints for 0603, 1206, and PTH resistors.
R37-R44 R52-R56 = SparkFun-Passives:RESISTOR: Resistor Basic schematic elements and footprints for 0603, 1206, and PTH resistors.
R57 R58 R66 = rcl:R-EU_: RESISTOR, European symbol
R64 R65 R70 R71 = SparkFun:RESISTOR: Resistor Basic schematic elements and footprints for 0603, 1206, and PTH resistors.
S1 = SparkFun-Electromechanical_bak:SWITCH-SPDT: SPDT Switch Simple slide switch, Spark Fun Electronics SKU : COM-00102 DPDT SMT slide switch, AYZ0202, SWCH-08179
S2-S4 = SparkFun-Electromechanical:SWITCH-MOMENTARY-2: Various NO switches- pushbuttons, reed, etc; PROD_ID: SWCH-08247
SJ1-SJ4 = SparkFun-Retired:SOLDERJUMPER: Solder Jumper Standard SMD solder jumper. Used to automate production. Two varients : Normally Open and Normally Closed are the same, but have different paste layers. NC will have a large amount of paste and should jumper during reflow.
U1 = ADAS1000:ADAS1000BSTZ
U2 = LAN9512:LAN9512-JZX: IC, USB2 - ENET CNTRL 2-PORT HUB, 64VQFN; MPN: LAN9512-JZX; OC_FARNELL: 2292586; OC_NEWARK: 66W1988; PACKAGE: 64VQFN; SUPPLIER: Microchip
U5 = AP7115-25SEG:74LVC1G79
U6 = SparkFun:MCP73831: Microchip's MCP73831 Miniature single cell, fully integrated Li-Ion, Li-polymer charge management controller http://ww1.microchip.com/downloads/en/DeviceDoc/21984a.pdf
U7 = raspi:RASPI
U8 = SparkFun:TPS61200: DC to DC Booster
U$1 = PAM2306AY:WDFN-12L: PAM2306AY
USB1 = 72309:72309
USBPOWER = SparkFun-Retired:JUMPER-2: Jumper Basic 0.1" spaced jumper. Use with breakaway headers.
Y1 = CRYSTAL:CRYSTAL